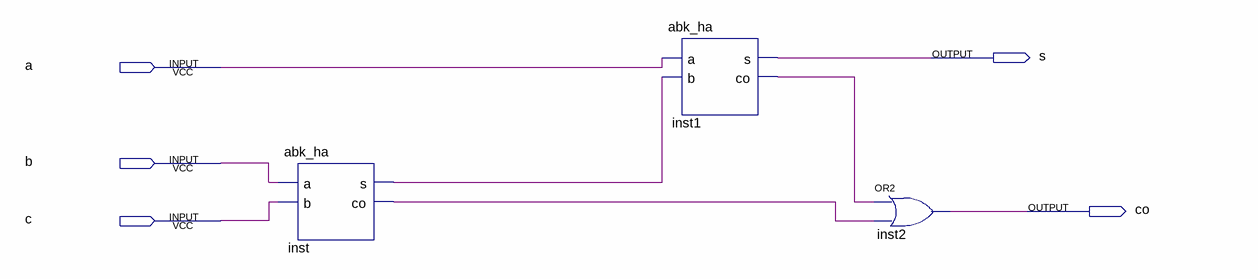
[diagram p0: schematic sheet]
// Quartus schematic abk_fa1.bdf as structural Verilog: 3 symbols, 5 pins
module abk_fa1 (
  input  a,
  input  b,
  input  c,
  output s,
  output co
);

  wire inst1_co, inst_co, inst_s;

  abk_ha inst (.a(b), .b(c), .s(inst_s), .co(inst_co));
  abk_ha inst1 (.a(a), .b(inst_s), .s(s), .co(inst1_co));
  or inst2 (co, inst1_co, inst_co);
endmodule
